# EAGLE design rvb-micromatch (EAGLE 4.11)
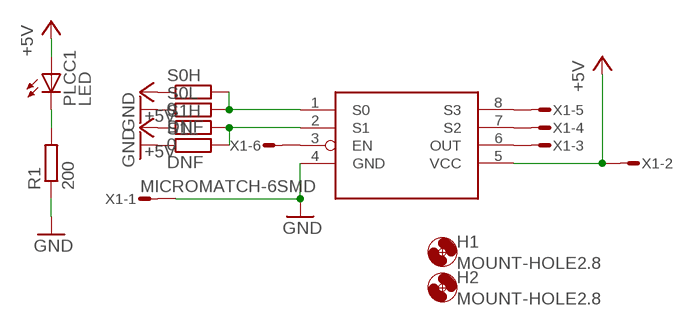
[diagram p0: schematic, sheet 1]

## Parts
H1  MOUNT-HOLE2.8  [2,8]
H2  MOUNT-HOLE2.8  [2,8]
PLCC1  LED  [P-LCC-2]
R1  200  R-EU_R1206  [R1206]
S0H  0  R-EU_R1206  [R1206]
S0L  DNF  R-EU_R1206  [R1206]
S1H  0  R-EU_R1206  [R1206]
S1L  DNF  R-EU_R1206  [R1206]
U$1  TCS230  [SOIC8]
X1  MICROMATCH-6SMD  [MICROMATCH-6-SMD]

## Nets
+5V: PLCC1.A S0H.1 S1H.1 U$1.5(VCC) X1.2
GND: R1.1 S0L.1 S1L.1 U$1.4(GND) X1.1
N$1: PLCC1.C R1.2
N$2: S1H.2 S1L.2 U$1.2(S1)
N$3: S0H.2 S0L.2 U$1.1(S0)
N$4: U$1.6(OUT) X1.3
N$5: U$1.7(S2) X1.4
N$6: U$1.8(S3) X1.5
N$7: U$1.3(EN) X1.6

## Library data of the parts
H1 H2 = holes:MOUNT-HOLE: MOUNTING HOLE with drill center marker
PLCC1 = robot:LED
R1 S0H S0L S1H S1L = rcl:R-EU_: RESISTOR, European symbol
U$1 = tcs230:TCS230
X1 = robot_con-amp-micromatch:MICROMATCH-6: MicroMaTch 6 7-215464-6 / 0-215464-6 Drawing Number C-215464 DDEController.pdf

## Board
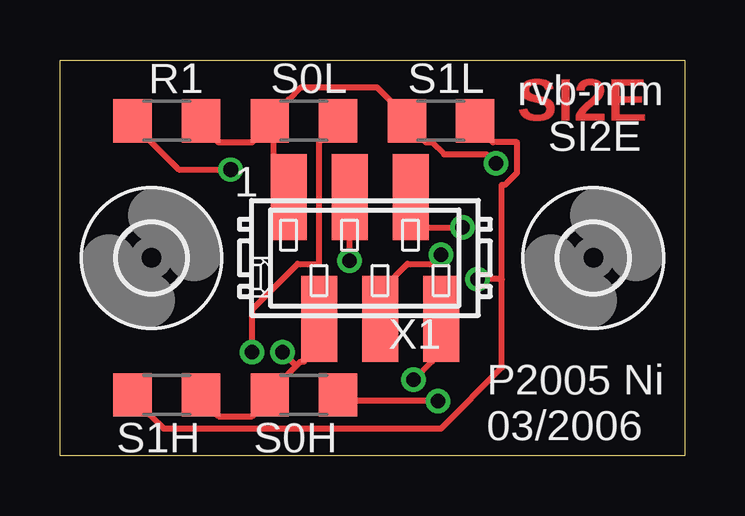
[diagram p1: board, top side]
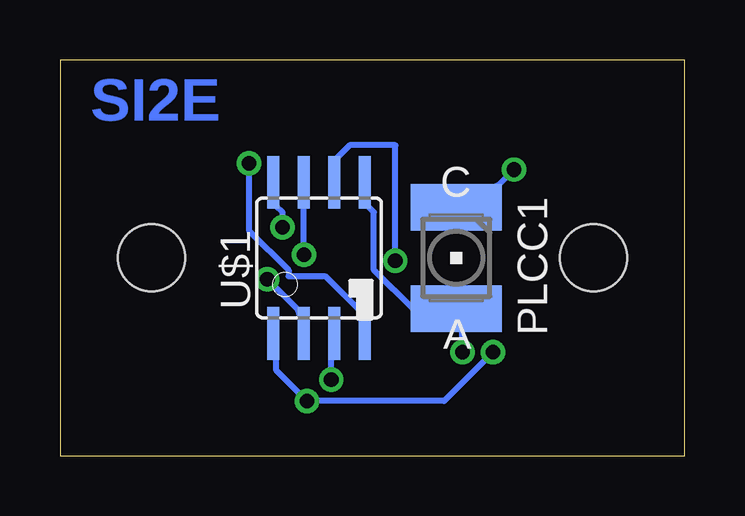
[diagram p2: board, bottom side, seen from below]

Size 26.04 x 16.51 mm. Coordinates in mm from the lower left corner, seen from the top.
Outline: 0,0 0,16.51 26.04,16.51 26.04,0 0,0
Copper layers (1*16): Top 0.035mm / dielectric 1.5mm / Bottom 0.035mm
Design rules "olimex": minimum track width 10mil, minimum drill 24mil, track to track 10mil, track to pad 10mil, pad to pad 10mil, via to via 10mil, smd to smd 10mil, copper to edge 40mil, drill to drill 10mil, minimum pad ring 10mil, minimum via ring 8mil, stop-mask expansion 0mil, vias tented up to drill 0mil, thermal gap 10mil

### Footprints (pad centres in the part's own frame; a part is rotated, then mirrored left to right if it is on the bottom)
2,8 = hole 2.8: 0,0
P-LCC-2 = smd 3.81 x 1.93: A 0,2.75; C 0,-1.48
R1206 = smd 1.6 x 1.803: 1 -1.422,0; 2 1.422,0
SOIC8 = smd 0.5 x 2.2: 1 -1.905,-3.154; 2 -0.645,-3.154; 3 0.625,-3.154; 4 1.895,-3.154; 5 1.905,3.154; 6 0.635,3.154; 7 -0.635,3.154; 8 -1.905,3.154
MICROMATCH-6-SMD = smd 1.5 x 3.58: 1 3.175,-2.54; 2 1.905,2.54; 3 0.635,-2.54; 4 -0.635,2.54; 5 -1.905,-2.54; 6 -3.175,2.54

### Placement (x,y rotation side)
H1  3.81,8.26 0 top
H2  22.23,8.26 0 top
PLCC1  9.53,8.89 180 bottom
R1  4.45,13.97 180 top
S0H  10.16,2.54 0 top
S0L  10.16,13.97 0 top
S1H  4.45,2.54 180 top
S1L  15.88,13.97 0 top
U$1  15.24,8.26 0 bottom
X1  12.7,8.26 180 top

### Tracks (layer width: path | path; a pad name or v marks a point on that pad's centre or on a via)
+5V  (via drill 0.61)
  Top 0.254: S1H.1 6.6,1.65 8,1.65 S0H.1 9.53,3.43 9.84,3.75 | 9.84,3.75 10.03,3.94 10.16,3.94 X1.2 | 9.84,3.75 v9.27,4.32
  Bottom 0.254: U$1.5 13.21,10.41 12.95,10.16 12.95,7.75 11.3,6.1 PLCC1.A 9.27,5.21 v9.27,4.32
GND  (via drill 0.61)
  Top 0.254: R1.1 6.6,13.08 8,13.08 S0L.1 | S0L.1 9.53,14.86 10.03,15.37 13.21,15.37 13.72,14.86 S1L.1 15.24,13.08 15.49,13.08 16,12.57 17.78,12.57 v18.16,12.19 | X1.1 8.89,12.57 8.89,13.08 S0L.1
  Bottom 0.254: v18.16,12.19 18.16,9.4 16.51,7.75 16.51,7.49 14.99,7.49 13.59,6.1 U$1.4
N$1  (via drill 0.61)
  Top 0.254: v7.11,11.94 4.95,11.94 3.81,13.08 R1.2
  Bottom 0.254: v7.11,11.94 7.75,11.3 PLCC1.C
N$2  (via drill 0.61)
  Top 0.254: 18.41,7.37 18.41,11.3 18.54,11.3 19.05,11.81 19.05,13.08 18.03,13.08 S1L.2 | 18.41,7.37 18.41,3.68 15.88,1.14 4.32,1.14 3.81,1.65 S1H.2 | 18.41,7.37 v17.4,7.37
  Bottom 0.254: v17.4,7.37 16.13,6.1 U$1.2
N$3  (via drill 0.61)
  Top 0.254: v15.75,2.29 12.32,2.29 S0H.2 | v8,4.32 8,6.1 9.91,8 10.79,8 10.79,13.08 S0L.2
  Bottom 0.254: U$1.1 17.02,4.06 17.02,3.56 v15.75,2.29 10.03,2.29 v8,4.32
N$4  (via drill 0.61)
  Top 0.254: v12.06,8.13 X1.3
  Bottom 0.254: v12.06,8.13 12.06,12.95 13.97,12.95 14.48,12.45 U$1.6
N$5  (via drill 0.61)
  Top 0.254: v15.88,8.38 15.49,8 14.48,8 13.97,7.49 X1.4
  Bottom 0.254: v15.88,8.38 U$1.7
N$6  (via drill 0.61)
  Top 0.254: v16.76,9.53 15.24,9.53 X1.5
  Bottom 0.254: v16.76,9.53 16.76,10.16 17.02,10.41 U$1.8
N$7  (via drill 0.61)
  Top 0.254: v14.73,3.17 15.49,3.94 X1.6
  Bottom 0.254: v14.73,3.17 14.73,4.06 U$1.3

### Text on the board
Top: SI2E
Bottom: SI2E
tNames: rvb-mm | SI2E | P2005 Ni | 03/2006